# EAGLE schematic esp32_samostatny (EAGLE 9.0.1)
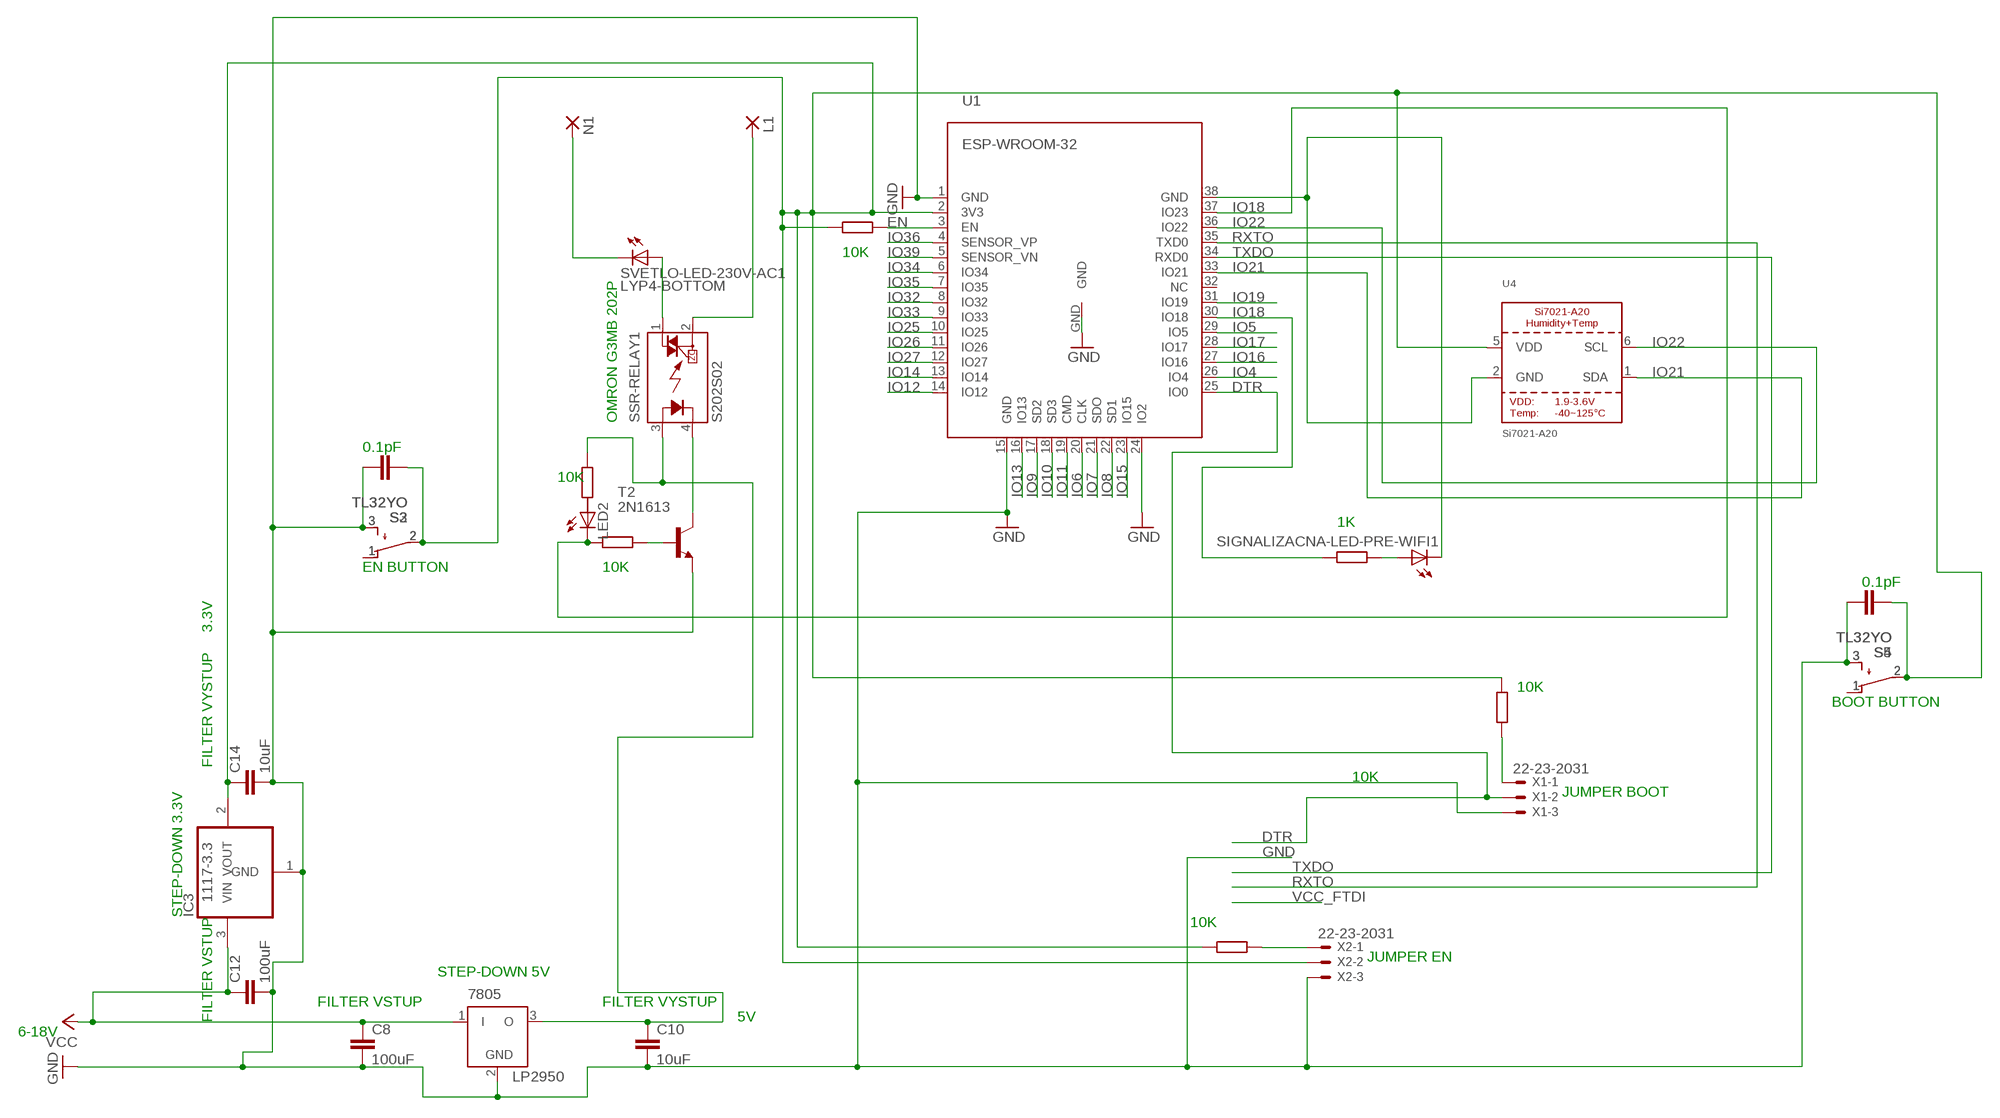
[diagram p0: schematic, sheet 1]

## Parts
7805  LP2950  [DPACK]
C8  100uF  C5/3  [C5B3]
C10  10uF  C5/3  [C5B3]
C12  100uF  C5/3  [C5B3]
C14  10uF  C5/3  [C5B3]
IC3  1117-3.3  REG1117  [SOT223]
L1  1,6/0,8  [1,6/0,8]
LED2  LEDB153  [Q62902-B153]
N1  1,6/0,8  [1,6/0,8]
S2  TL32YO  [TL3XYO]
S3  TL32YO  [TL3XYO]
S4  TL32YO  [TL3XYO]
S5  TL32YO  [TL3XYO]
SIGNALIZACNA-LED-PRE-WIFI1  LEDCHIP-LED0603  [CHIP-LED0603]
SSR-RELAY1  S202S02  [S202S02]
SVETLO-LED-230V-AC1  LYP4-BOTTOM  [P47F-BOTTOM]
T2  2N1613  [TO5]
U1  ESP-WROOM-32  [ESP-WROOM-32]
U4  Si7021-A20  SI7021-A20  [DFN6_3X3_SI]
X1  22-23-2031  [22-23-2031]
X2  22-23-2031  [22-23-2031]

## Nets
DTR: U1.25(IO0) X1.2
EN: C14.1 IC3.2(VOUT) S2.2(P) S3.2(P) S4.2(P) S5.2(P) U1.2(3V3) U4.5(VDD)
GND [gnd]: 7805.2(GND) C8.2 C10.2 C12.2 C14.2 IC3.1(GND) S2.3(S) S3.3(S) S4.3(S) S5.3(S) T2.1(E) U1.1(GND) U1.15(GND) U1.24(IO2) U1.GND X1.3 X2.3
IO4: U1.26(IO4)
IO5: U1.29(IO5)
IO6: U1.20(CLK)
IO7: U1.21(SDO)
IO8: U1.22(SD1)
IO9: U1.17(SD2)
IO10: U1.18(SD3)
IO11: U1.19(CMD)
IO12: U1.14(IO12)
IO13: U1.16(IO13)
IO14: U1.13(IO14)
IO15: U1.23(IO15)
IO16: U1.27(IO16)
IO17: U1.28(IO17)
IO18: U1.30(IO18)
IO19: U1.31(IO19)
IO21: U1.33(IO21) U4.1(SDA)
IO22: U1.36(IO22) U4.6(SCL)
IO25: U1.10(IO25)
IO26: U1.11(IO26)
IO27: U1.12(IO27)
IO32: U1.8(IO32)
IO33: U1.9(IO33)
IO34: U1.6(IO34)
IO35: U1.7(IO35)
IO36: U1.4(SENSOR_VP)
IO39: U1.5(SENSOR_VN)
N$1: X1.1
N$2: X2.1
N$3: U1.3(EN)
N$6: S2.1(O) S3.1(O)
N$7: S4.1(O) S5.1(O)
N$8 [gnd]: SIGNALIZACNA-LED-PRE-WIFI1.C U1.38(GND) U4.2(GND)
N$10: N1.1(P) SVETLO-LED-230V-AC1.C
N$11: L1.1(P) SSR-RELAY1.2(DS2)
N$12: SSR-RELAY1.1(DS1) SVETLO-LED-230V-AC1.A
N$13: SIGNALIZACNA-LED-PRE-WIFI1.A
N$14: 7805.3(O) C10.1 SSR-RELAY1.3(A)
N$15: SSR-RELAY1.4(K) T2.3(C)
N$16: T2.2(B)
N$17: LED2.K(C) U1.37(IO23)
RXTO: U1.35(TXD0)
TXDO: U1.34(RXD0)
VCC: 7805.1(I) C8.1 C12.1 IC3.3(VIN)
Unconnected: LED2.A U1.32(NC) X2.2

## Notes on the sheet
- 10K
- OMRON G3MB 202P
- 0.1pF
- 10K
- 1K
- EN BUTTON | 10K
- 0.1pF
- 3.3V
- 10K
- BOOT BUTTON
- FILTER VYSTUP
- 10K
- JUMPER BOOT
- STEP-DOWN 3.3V | 10K
- JUMPER EN
- STEP-DOWN 5V
- FILTER VSTUP | FILTER VYSTUP
- FILTER VSTUP | 5V
- 6-18V

## Library data of the parts
7805 = linear:LP2950: 100 mA, Low Power Low Dropout Voltage Regulator Source: http://www.onsemi.com/pub/Collateral/LP2950-D.PDF
C8 C10 C12 C14 = capacitor-wima:C: CAPACITOR naming: grid - package width
IC3 = burr-brown:REG1117: 800mA and 1A Low Dropout (LDO) Positive Regulator 1.8V, 2.5V, 2.85V, 3.3V, 5V, and Adj; MPN: REG1117; OC_FARNELL: 1097566; OC_NEWARK: 14P6981
L1 N1 = wirepad:1,6/0,8: THROUGH-HOLE PAD
LED2 SIGNALIZACNA-LED-PRE-WIFI1 = adafruit:LED: LED OSRAM: - CHIPLED LG R971, LG N971, LY N971, LG Q971, LY Q971, LO R971, LY R971 LH N974, LH R974 LS Q976, LO Q976, LY Q976 LO Q996 - Hyper CHIPLED LW Q18S LB Q993, LB Q99A, LB R99A - SideLED LS A670, LO A670, LY A670, LG A670, LP A670 LB A673, LV A673, LT A673, LW A673 LH A674 LY A675 LS A676, LA A676, LO A676, LY A676, LW A676 LS A679, LY A679, LG A679 - Hyper Micro SIDELED® LS Y876, LA Y876, LO Y876, LY Y876 LT Y87S - SmartLED LW L88C, LW L88S LB L89C, LB L89S, LG L890 LS L89K, LO L89K, LY L89K LS L896, LA L896, LO L896, LY L896 - TOPLED LS T670, LO T670, LY T670, LG T670, LP T670 LSG T670, LSP T670, LSY T670, LOP T670, LYG T670 LG T671, LOG T671, LSG T671 LB T673, LV T673, LT T673, LW T673 LH T674 LS T676, LA T676, LO T676, LY T676, LB T676, LH T676, LSB T676, LW T676 LB T67C, LV T67C, LT T67C, LS T67K, LO T67K, LY T67K, LW E67C LS E67B, LA E67B, LO E67B, LY E67B, LB E67C, LV E67C, LT E67C LW T67C LS T679, LY T679, LG T679 LS T770, LO T770, LY T770, LG T770, LP T770 LB T773, LV T773, LT T773, LW T773 LH T774 LS E675, LA E675, LY E675, LS T675 LS T776, LA T776, LO T776, LY T776, LB T776 LHGB T686 LT T68C, LB T68C - Hyper Mini TOPLED® LB M676 - Mini TOPLED Santana® LG M470 LS M47K, LO M47K, LY M47K Source: http://www.osram.convergy.de/
S2-S5 = switch:TL32YO: TINY SWITCH ON - MOM Source: http://www2.produktinfo.conrad.com/datenblaetter/700000-724999/705152-da-01-de-Subminiaturschalter_TL_36YO.pdf
SSR-RELAY1 = relay:S*02S02: IT(rms) 8A, Zero Cross type SIP 4pin Triac output SSR Source: http://sharp-world.com/products/device/lineup/data/pdf/datasheet/s102s02_e.pdf; MPN: S202S02F; OC_FARNELL: 1618475; OC_NEWARK: 14N9588
SVETLO-LED-230V-AC1 = led:*P4: PointLED® Enhanced Thinfilm LED TOP & BOTTOM mount LS P47F, LR P47F, LA P47F, LY P47F, LT P4SG, LB P4SG, LW P4SG Source: http://catalog.osram-os.com .. LA_LR_LS_LY_P47F_Pb_free.pdf
T2 = transistor:2N1613: NPN TRANSISTOR
U1 = esp32:ESP-WROOM-32
U4 = microbuilder:SI7021-A20: Si7021-A20 - I2C Humidity and Temperature Sensor VDD: 1.9-3.6V Operating Temperature: -40~125°C +/-3% RH (max) 0..80% RH Humidity Sensor +/-0.4°C (max-, -10~85°C Temperature Sensor 150uA Active, 60nA Standby
X1 X2 = con-molex:22-23-2031: .100" (2.54mm) Center Header - 3 Pin; MF: MOLEX; MPN: 22-23-2031; OC_FARNELL: 1462950; OC_NEWARK: 30C0862

## Net classes
1 gnd: width 0.635 mm, drill 0.635 mm, clearance 0.254 mm
2 vcc: width 0.406 mm, drill 0.406 mm, clearance 0.254 mm